# Altium project mb1367.PrjPcb
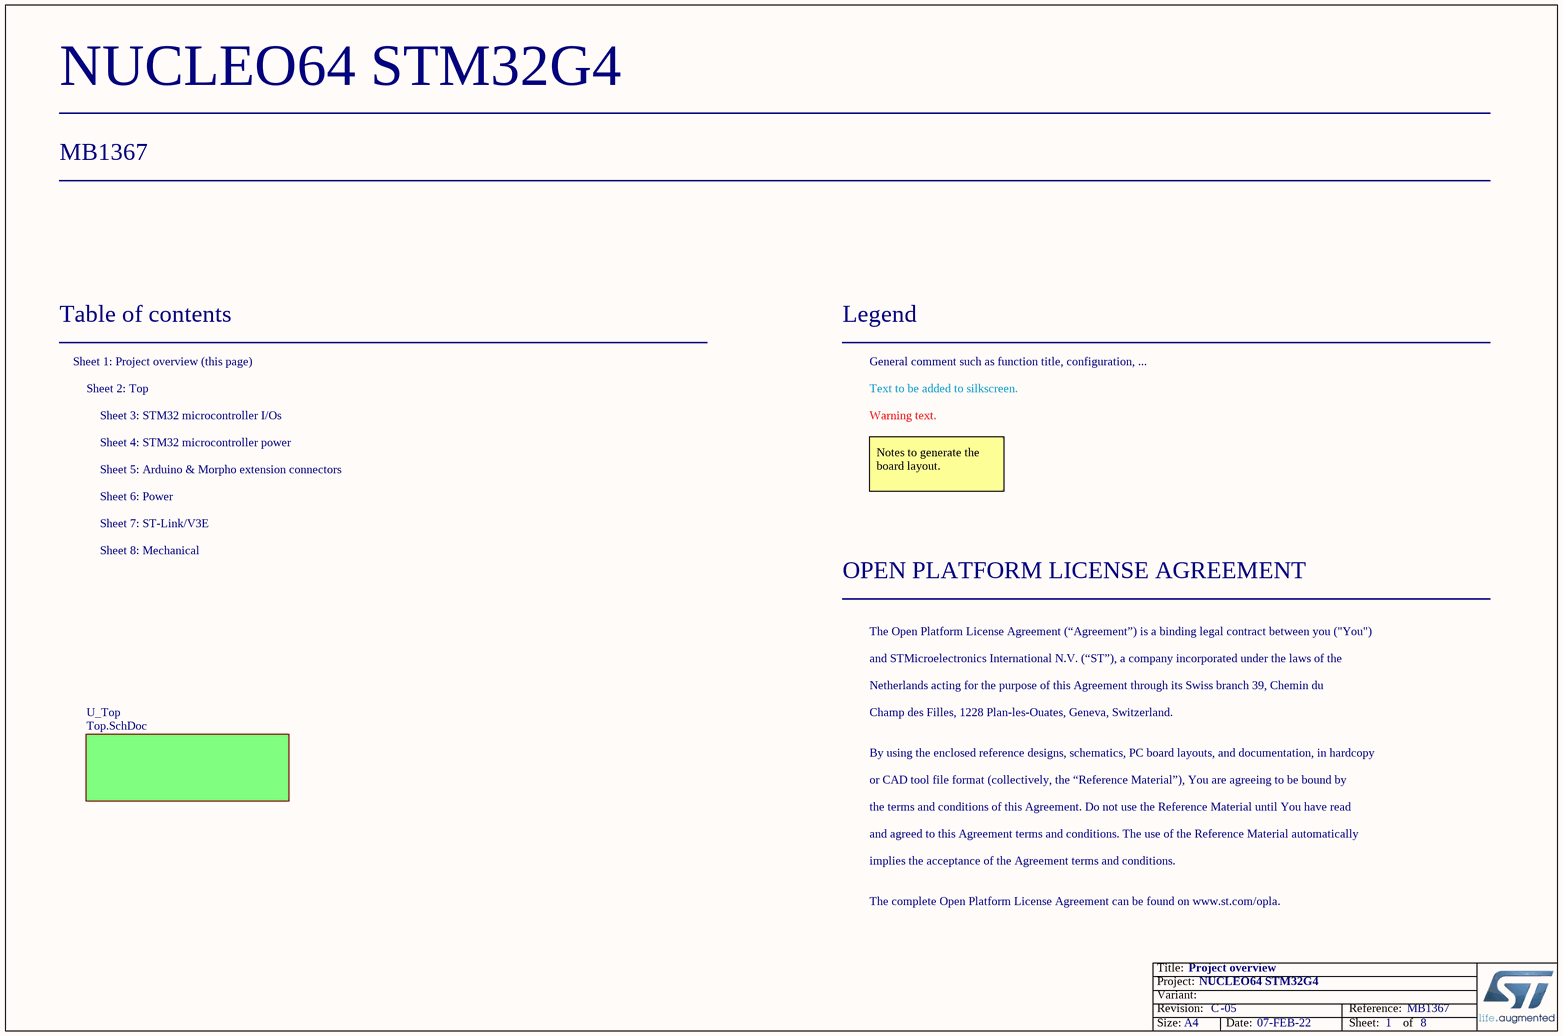
[diagram p0: Project_Overview.SchDoc]
Board_Assembly_Revision: 05; Board_Document_Date: 07-FEB-22; Board_Name: NUCLEO64 STM32G4; Board_PCB_Revision: C; Board_Reference: MB1367
4 sheets, 128 parts. Net scope: flat (ports and power ports of the same name join across sheets).
Board file: MB1367.PcbDoc
Sheets:
  Project_Overview.SchDoc
  Arduino_extension_connectors.SchDoc
  Power.SchDoc
  ST_LINK_V3E.SchDoc

## Sheet Project_Overview.SchDoc: Project overview
size A4; Date: Not used; ApprovedBy: Not used; CheckedBy: Not used; Author: Not used; CompanyName: STMicroelectronics; DrawnBy: Not used; Engineer: Not used; Organization: Not used; Address1: Not used; Address2: Not used; Address3: Not used; Address4: Not used; DocumentNumber: 1; Revision: Not used; SheetNumber: 1; SheetTotal: 8; CurrentTime: Not used; CurrentDate: Not used; Time: Not used; DocumentFullPathAndName: Not used; DocumentName: Not used; ModifiedDate: Not used; ImagePath: Not used; ProjectName: Not used; Application_BuildNumber: Not used

### Sub-sheets
U_Top = Top.SchDoc (file not in this document): no entries

### Notes on the sheet
- Table of contents
- Sheet 1: Project overview (this page)
- Legend
- General comment such as function title, configuration, ...
- Sheet 2: Top
- Sheet 4: STM32 microcontroller power
- Sheet 3: STM32 microcontroller I/Os
- Text to be added to silkscreen.
- Warning text.
- Sheet 6: Power
- Sheet 5: Arduino & Morpho extension connectors
- Notes to generate the board layout.
- Sheet 7: ST-Link/V3E
- Sheet 8: Mechanical
- OPEN PLATFORM LICENSE AGREEMENT
- The Open Platform License Agreement (“Agreement”) is a binding legal contract between you ("You")
- and STMicroelectronics International N.V. (“ST”), a company incorporated under the laws of the
- Netherlands acting for the purpose of this Agreement through its Swiss branch 39, Chemin du
- Champ des Filles, 1228 Plan-les-Ouates, Geneva, Switzerland.
- By using the enclosed reference designs, schematics, PC board layouts, and documentation, in hardcopy
- or CAD tool file format (collectively, the “Reference Material”), You are agreeing to be bound by
- the terms and conditions of this Agreement. Do not use the Reference Material until You have read
- and agreed to this Agreement terms and conditions. The use of the Reference Material automatically
- implies the acceptance of the Agreement terms and conditions.
- The complete Open Platform License Agreement can be found on www.st.com/opla.
- Title:
- Project:
- Size:
- Revision:
- Variant:
- A4
- -
- Date:
- Reference:
- Sheet:
- of

## Sheet Arduino_extension_connectors.SchDoc: Arduino & Morpho extension connectors
size A4; Date: Not used; ApprovedBy: Not used; CheckedBy: Not used; Author: Not used; CompanyName: STMicroelectronics; DrawnBy: Not used; Engineer: Not used; Organization: Not used; Address1: Not used; Address2: Not used; Address3: Not used; Address4: Not used; DocumentNumber: 5; Revision: Not used; SheetNumber: 5; SheetTotal: 8; CurrentTime: Not used; CurrentDate: Not used; Time: Not used; DocumentFullPathAndName: Not used; DocumentName: Not used; ModifiedDate: Not used; ImagePath: Not used; ProjectName: Not used; Application_BuildNumber: Not used
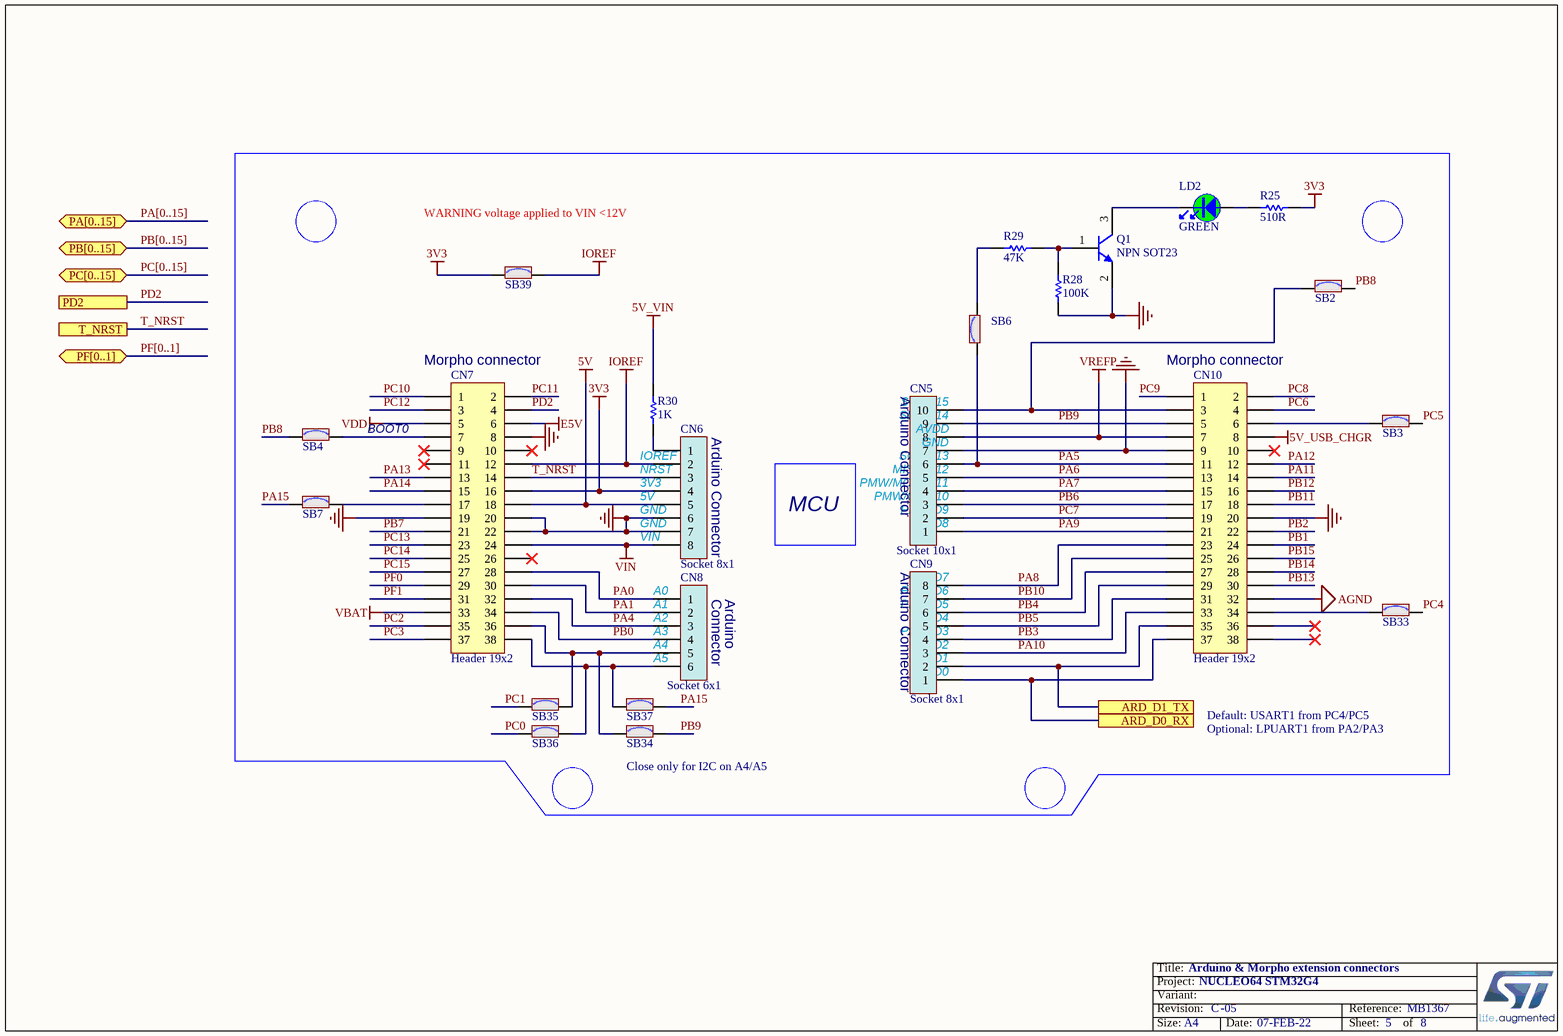
[diagram p1: Arduino_extension_connectors.SchDoc]

### Parts
CN5  value Socket 10x1  [CON_SAMTEC_SSW-110-03-X-S]
CN6  value Socket 8x1  [CON_SAMTEC_SSW-108-03-X-S]
CN7  value Header 19x2  [CON_SAMTEC_TSW-119-09-X-D]
CN8  value Socket 6x1  [CON_SAMTEC_SSW-106-03-X-S]
CN9  value Socket 8x1  [CON_SAMTEC_SSW-108-03-X-S]
CN10  value Header 19x2  [CON_SAMTEC_TSW-119-09-X-D]
LD2  value GREEN  [LED_0603_GREEN]  (hidden comment: LED_green)
Q1  value NPN SOT23  [NPN_SOT23]
R25  value 510R  [R0603]
R28  value 100K  [R0603]
R29  value 47K  [R0603]
R30  value 1K  [R0603]
SB2  (no value)  [SOLDER-BRIDGE_R0603-0R]
SB3  (no value)  [SOLDER-BRIDGE_R0603-0R]
SB4  (no value)  [SOLDER-BRIDGE_R0603-0R]
SB6  (no value)  [SOLDER-BRIDGE_R0603-0R]
SB7  (no value)  [SOLDER-BRIDGE_R0603-0R]
SB33  (no value)  [SOLDER-BRIDGE_R0603-0R]
SB34  (no value)  [SOLDER-BRIDGE_R0603-0R]
SB35  (no value)  [SOLDER-BRIDGE_R0603-0R]
SB36  (no value)  [SOLDER-BRIDGE_R0603-0R]
SB37  (no value)  [SOLDER-BRIDGE_R0603-0R]
SB39  (no value)  [SOLDER-BRIDGE_R0603-0R]

### Ports
ARD_D0_RX, ARD_D1_TX, PA[0..15] (bidir), PB[0..15] (bidir), PC[0..15] (bidir), PD2, PF[0..1] (bidir), T_NRST

### Nets
3V3: CN6.4 CN7.16 R25.1 SB39.1
5V: CN6.5 CN7.18
5V_USB_CHGR: CN10.8
5V_VIN: R30.2
AGND: CN10.32
E5V: CN7.6
GND: CN5.7 CN6.6 CN6.7 CN7.8 CN7.19 CN7.20 CN7.22 CN10.9 CN10.20 Q1.2(E) R28.1
IOREF: CN6.2 CN7.12 SB39.2
VBAT: CN7.33
VDD: CN7.5
VIN: CN6.8 CN7.24
VREFP: CN5.8 CN10.7
ARD_D0_RX: CN9.1 CN10.37 ; port ARD_D0_RX
ARD_D1_TX: CN9.2 CN10.35 ; port ARD_D1_TX
PA0: CN7.28 CN8.1
PA1: CN7.30 CN8.2
PA4: CN7.32 CN8.3
PA5: CN5.6 CN10.11 SB6.1
PA6: CN5.5 CN10.13
PA7: CN5.4 CN10.15
PA8: CN9.8 CN10.23
PA9: CN5.1 CN10.21
PA10: CN9.3 CN10.33
PA11: CN10.14
PA12: CN10.12
PA13: CN7.13
PA14: CN7.15
PA15: SB7.1 SB37.2
PB0: CN7.34 CN8.4
PB1: CN10.24
PB2: CN10.22
PB3: CN9.4 CN10.31
PB4: CN9.6 CN10.27
PB5: CN9.5 CN10.29
PB6: CN5.3 CN10.17
PB7: CN7.21
PB8: SB2.2 SB4.1
PB9: CN5.9 CN10.5 SB34.2
PB10: CN9.7 CN10.25
PB11: CN10.18
PB12: CN10.16
PB13: CN10.30
PB14: CN10.28
PB15: CN10.26
PC0: SB36.1
PC1: SB35.1
PC2: CN7.35
PC3: CN7.37
PC4: SB33.2
PC5: SB3.2
PC6: CN10.4
PC7: CN5.2 CN10.19
PC8: CN10.2
PC9: CN10.1
PC10: CN7.1
PC11: CN7.2
PC12: CN7.3
PC13: CN7.23
PC14: CN7.25
PC15: CN7.27
PD2: CN7.4 ; port PD2
PF0: CN7.29
PF1: CN7.31
T_NRST: CN6.3 CN7.14 ; port T_NRST
NetCN5_10: CN5.10 CN10.3 SB2.1
NetCN6_1: CN6.1 R30.1
NetCN7_7: CN7.7 SB4.2
NetCN7_17: CN7.17 SB7.2
NetCN7_36: CN7.36 CN8.5 SB34.1 SB35.2
NetCN7_38: CN7.38 CN8.6 SB36.2 SB37.1
NetCN10_6: CN10.6 SB3.1
NetCN10_34: CN10.34 SB33.1
NetLD2_1: LD2.1 R25.2
NetLD2_2: LD2.2 Q1.3(C)
NetQ1_1: Q1.1(B) R28.2 R29.2
NetR29_1: R29.1 SB6.2

Not connected (* = marked no-connect by the designer): CN7 9* 10* 11* 26*; CN10 10* 36* 38*

### Buses and harness runs
bus PA[0..15] = port PA[0..15]
bus PB[0..15] = port PB[0..15]
bus PC[0..15] = port PC[0..15]
bus PF[0..1] = port PF[0..1]

### Notes on the sheet
- WARNING voltage applied to VIN <12V
- (near CN7) Morpho connector
- (near CN10) Morpho connector
- (near CN7) BOOT0
- (near CN6) Arduino Connector
- (near CN5) Arduino Connector
- (near CN5) SDA/D14
- (near CN5) SCL/D15
- (near CN5) AVDD
- (near CN5) GND
- (near CN6) GND
- (near CN6) 5V
- (near CN6) 3V3
- (near CN6) NRST
- (near CN6) IOREF
- MCU
- (near CN5) PMW/D9
- (near CN5) PMW/CS/D10
- (near CN5) SCK/D13
- (near CN5) MISO/D12
- (near CN5) PMW/MOSI/D11
- (near CN6) VIN
- (near CN9) Arduino Connector
- (near CN9) D7
- (near CN5) D8
- (near CN8) A0
- (near CN8) A1
- (near CN8) A2
- (near CN8) A3
- (near CN8) A4
- (near CN8) Connector
- (near CN8) Arduino
- (near CN9) D2
- (near CN9) D4
- (near CN9) PMW/D3
- (near CN9) PMW/D5
- (near CN9) PMW/D6
- (near CN8) A5
- (near CN9) RX/D0
- (near CN9) TX/D1
- (near SB34) Close only for I2C on A4/A5
- Default: USART1 from PC4/PC5
  Optional: LPUART1 from PA2/PA3
- Title:
- Project:
- Size:
- Revision:
- Variant:
- -
- Date:
- Reference:
- Sheet:
- of

### Library data of the parts
CN5 = MCD-00262: Socket, 10x1, 2.54mm, VR, TH, Height 8.51mm/10mm; Manufacturer_Part_Number: SSW-110-03-x-S; Manufacturer: SAMTEC; Part_Type: Connector; Provided_By: SUBCO; Internal_Part_Number: MCD-00262; ECCN_US: n/a; ECCN_EU: n/a; ComponentLink1Description: Datasheet; Status: Released; ComponentLink1URL: http://tunmcdsvn.tun.st.com/Component_Datasheet_Library/Trunk/Connectors/Samtec_SSW-SSQ-series
CN6 CN9 = MCD-00261: Socket, 8x1, 2.54mm, VR, TH, Height 8.51mm/10mm; Manufacturer_Part_Number: SSW-108-03-x-S; Manufacturer: SAMTEC; Part_Type: Connector; Provided_By: SUBCO; Internal_Part_Number: MCD-00261; ECCN_US: n/a; ECCN_EU: n/a; ComponentLink1Description: Datasheet; Status: Released; ComponentLink1URL: http://tunmcdsvn.tun.st.com/Component_Datasheet_Library/Trunk/Connectors/Samtec_SSW-SSQ-series
CN7 CN10 = MCD-00213: Header, 19x2, 2,54mm, VR, TH, Height 5.84mm/10.16mm; Manufacturer_Part_Number: TSW-119-09-x-D; Manufacturer: SAMTEC; Part_Type: Connector; Provided_By: SUBCO; Internal_Part_Number: MCD-00213; ECCN_US: n/a; ECCN_EU: n/a; ComponentLink1Description: Datasheet; Status: Released; ComponentLink1URL: http://tunmcdsvn.tun.st.com/Component_Datasheet_Library/Trunk/Connectors/Samtec_TSW-HTSW-series
CN8 = MCD-00260: Socket, 6x1, 2.54mm, VR, TH, Height 8.51mm/10mm; Manufacturer_Part_Number: SSW-106-03-x-S; Manufacturer: SAMTEC; Part_Type: Connector; Provided_By: SUBCO; Internal_Part_Number: MCD-00260; ECCN_US: n/a; ECCN_EU: n/a; ComponentLink1Description: Datasheet; Status: Released; ComponentLink1URL: http://tunmcdsvn.tun.st.com/Component_Datasheet_Library/Trunk/Connectors/Samtec_SSW-SSQ-series
LD2 = MCD-02520: LED, GREEN, 0603, VF : 2.4V max ; IF: 20mA; Part_Type: Display; Part_Preference: Recommended; Manufacturer: OSRAM OPTO SEMICONDUCTORS; Manufacturer_Part_Number: LG Q396-PS-35; ShowFields: YES; ID: 4626; Internal_Part_Number: MCD-02520; Status: Checked; Package: 0603; ComponentLink1URL: http://tunmcdsvn.tun.st.com/Component_Documentation_Library/Trunk/Display/OSRAM_LG-Q396_Series; Order_Code_Digikey: 475-3754-1-ND; Order_Code_Farnell: 2575345RL; Order_Code_RS: N/A
Q1 = MCD-00073: NPN Bipolar Transistor; Part_Type: IC; Manufacturer_Part_Number: BSR14; Manufacturer: ON SEMICONDUCTOR; Alternate_Manufacturer_Part_Number: MMBT2222LT1G / MMBT2222ALT1G / MMBT2222ALT3G; ECCN_US: EAR99; ECCN_EU: NEC; Provided_By: SUBCO; Revision: *; Internal_Part_Number: MCD-00073; Status: Released; ComponentLink1Description: Datasheet; ComponentLink1URL: http://tunmcdsvn.tun.st.com/Component_Datasheet_Library/Trunk/IC/NXP_Transistor_BSR14; Alternate_Manufacturer: ON SEMICONDUCTOR; Package: SOT23
R25 = MCD-00225: Resistor,510R,0603,1%,1/10W; Manufacturer_Part_Number: RC0603FR-07510RL; Manufacturer: YAGEO; ECCN_US: EAR99; ECCN_EU: NEC; Provided_By: SUBCO; Internal_Part_Number: MCD-00225; ComponentLink1Description: Datasheet; Status: Released; Part_Type: Resistor; Package: R0603; ComponentLink1URL: http://tunmcdsvn.tun.st.com/Component_Datasheet_Library/Trunk/Resistors/Yageo_Resistor_RC0603-series
R28 = MCD-00223: Resistor,100K,0603,1%,1/10W; Manufacturer_Part_Number: RC0603FR-07100KL; Manufacturer: YAGEO; Provided_By: Subcon; Initial_Board_Reference: MB1319; Internal_Part_Number: MCD-00223; Status: Released; Part_Type: Resistor; ComponentLink1Description: Yageo_Resistor_RC0603-series.pdf; ECCN_US: n/a; ECCN_EU: n/a; Package: R0603; ComponentLink1URL: http://tunmcdsvn.tun.st.com/Component_Datasheet_Library/Trunk/Resistors/Yageo_Resistor_RC0603-series
R29 = MCD-00222: Resistor,47K,0603,1%,1/10W; Manufacturer_Part_Number: RC0603FR-0747KL; Manufacturer: YAGEO; ECCN_US: EAR99; ECCN_EU: NEC; Provided_By: SUBCO; Internal_Part_Number: MCD-00222; Status: Released; Part_Type: Resistor; ComponentLink1Description: Datasheet; Package: R0603; ComponentLink1URL: http://tunmcdsvn.tun.st.com/Component_Datasheet_Library/Trunk/Resistors/Yageo_Resistor_RC0603-series
R30 = MCD-00070: Resistor,1K,0603,1%,1/10W; Manufacturer_Part_Number: RC0603FR-071KL; Manufacturer: YAGEO; Provided_By: Subcon; Initial_Board_Reference: MB1274; Internal_Part_Number: MCD-00070; ComponentLink1Description: Yageo_Resistor_RC0603-series.pdf; ECCN_US: n/a; ECCN_EU: n/a; Status: Released; Part_Type: Resistor; Package: R0603; ComponentLink1URL: http://tunmcdsvn.tun.st.com/Component_Datasheet_Library/Trunk/Resistors/Yageo_Resistor_RC0603-series
SB2-SB4 SB6 SB7 SB33-SB37 SB39 = MCD-00071: Solder Bridge ON; Part_Type: Mechanical; Manufacturer_Part_Number: RC0603JR-070RL; Manufacturer: YAGEO; Provided_By: SUBCO; Internal_Part_Number: MCD-00071; ECCN_US: n/a; ECCN_EU: n/a; Status: Released; Package: SB0603; ComponentLink1Description: Datasheet; ComponentLink1URL: http://tunmcdsvn.tun.st.com/Component_Datasheet_Library/Trunk/Resistors/Yageo_Resistor_RC0603-series

## Sheet Power.SchDoc: Main power 5V / 3V3
size A4; Date: Not used; ApprovedBy: Not used; CheckedBy: Not used; Author: Not used; CompanyName: STMicroelectronics; DrawnBy: Not used; Engineer: Not used; Organization: Not used; Address1: Not used; Address2: Not used; Address3: Not used; Address4: Not used; DocumentNumber: 6; Revision: Not used; SheetNumber: 6; SheetTotal: 8; CurrentTime: Not used; CurrentDate: Not used; Time: Not used; DocumentFullPathAndName: Not used; DocumentName: Not used; ModifiedDate: Not used; ImagePath: Not used; ProjectName: Not used; Application_BuildNumber: Not used
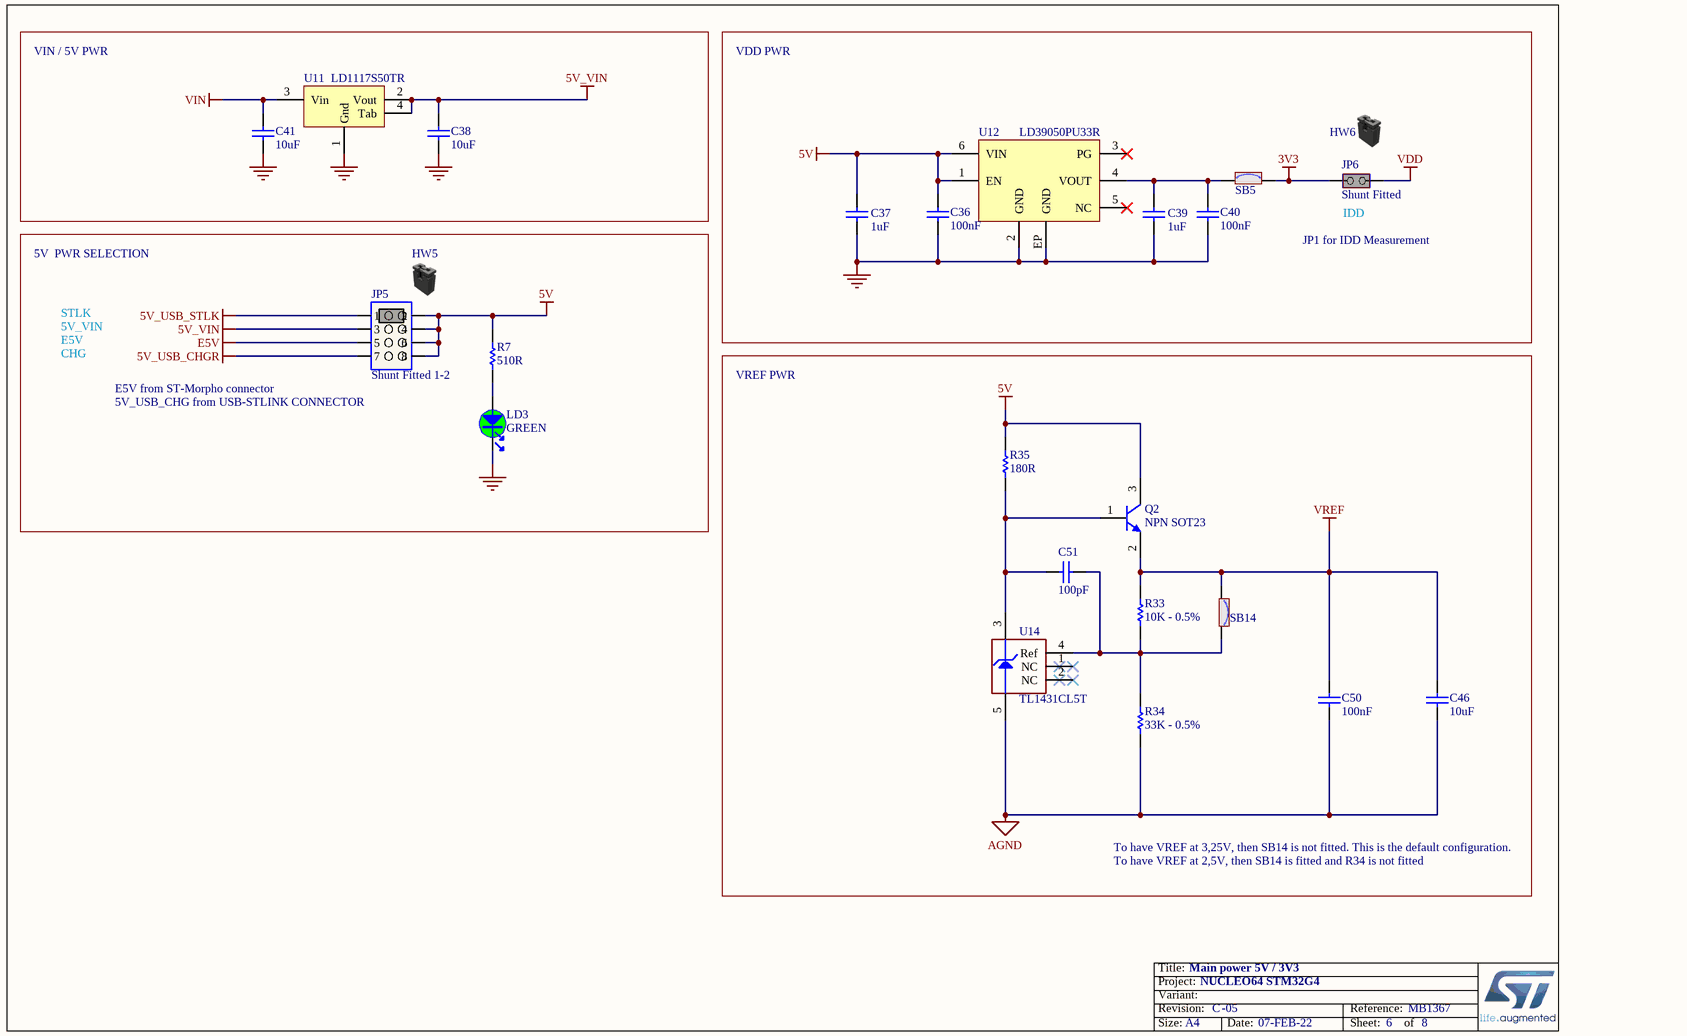
[diagram p2: Power.SchDoc]

### Parts
C36  value 100nF  [C0402]
C37  value 1uF  [C0603]
C38  value 10uF  [C0805]
C39  value 1uF  [C0603]
C40  value 100nF  [C0402]
C41  value 10uF  [C0805]
C46  value 10uF  [C0603]
C50  value 100nF  [C0603]
C51  value 100pF  [C0603]
HW5  (no value)  (mechanical)
HW6  (no value)  (mechanical)
JP5  value Shunt Fitted 1-2  [CON_SAMTEC_TSW-104-07-X-D]
JP6  Shunt Fitted  [CON_SAMTEC_TSW-102-07-G-S]
LD3  value GREEN  [LED_0603_GREEN]  (hidden comment: LED_green)
Q2  value NPN SOT23  [NPN_SOT23]
R7  value 510R  [R0603]
R33  value 10K - 0.5%  [R0603]
R34  value 33K - 0.5%  [R0603]
R35  value 180R  [R0603]
SB5  (no value)  [SOLDER-BRIDGE_R0603-0R]
SB14  (no value)  [SOLDER-BRIDGE_R0603-0R]
U11  value LD1117S50TR  [REG_SOT223-TAB]
U12  value LD39050PU33R  [ICC_DFN6-EPAD_3X3_P095]
U14  value TL1431CL5T  [ICC_SOT23-5L_H1P45]

### Blocks framed on the sheet
VIN / 5V PWR: C38 C41 U11
VREF PWR: C46 C50 C51 Q2 R33-R35 SB14 U14

### Nets
3V3: JP6.1(COMMON) SB5.2
5V: C36.2 C37.2 JP5.2 JP5.4 JP5.6 JP5.8 Q2.3(C) R7.2 R35.2 U12.1(EN) U12.6(VIN)
5V_USB_CHGR: JP5.7
5V_USB_STLK: JP5.1
5V_VIN: C38.2 JP5.3 U11.2(Vout) U11.4(Tab)
AGND: C46.1 C50.1 R34.1 U14.5(Anode)
E5V: JP5.5
GND: C36.1 C37.1 C38.1 C39.1 C40.1 C41.1 LD3.2 U11.1(Gnd) U12.2(GND) U12.EP(GND)
VDD: JP6.2(NO)
VIN: C41.2 U11.3(Vin)
VREF: C46.2 C50.2 Q2.2(E) R33.2 SB14.1
NetC39_2: C39.2 C40.2 SB5.1 U12.4(VOUT)
NetC51_1: C51.1 Q2.1(B) R35.1 U14.3(Cathode)
NetC51_2: C51.2 R33.1 R34.2 SB14.2 U14.4(Ref)
NetLD3_1: LD3.1 R7.1

Not connected (* = marked no-connect by the designer): U12 3(PG)* 5(NC)*; U14 1(NC)* 2(NC)*

### Notes on the sheet
- VDD PWR
- JP1 for IDD Measurement
- (near JP6) IDD
- 5V  PWR SELECTION
- STLK
- E5V
- 5V_VIN
- CHG
- E5V from ST-Morpho connector
- 5V_USB_CHG from USB-STLINK CONNECTOR
- To have VREF at 3,25V, then SB14 is not fitted. This is the default configuration.
- To have VREF at 2,5V, then SB14 is fitted and R34 is not fitted
- Title:
- Project:
- Size:
- Revision:
- Variant:
- A4
- -
- Date:
- Reference:
- Sheet:
- of

### Library data of the parts
C36 C40 = MCD-00102: Capacitor, MLCC, 100nF, 16V, X7R, 10%, 0402, T=0,5mm; Manufacturer_Part_Number: CC0402KRX7R7BB104; Manufacturer: YAGEO; Provided_By: Subcon; Initial_Board_Reference: MB1262; Internal_Part_Number: MCD-00102; Status: Released; Package: C0402; ComponentLink1Description: Yageo_Capacitor_X7R-series.pdf; ECCN_US: n/a; ECCN_EU: n/a; Part_Type: Capacitor; ComponentLink1URL: http://tunmcdsvn.tun.st.com/Component_Datasheet_Library/Trunk/Capacitors/Yageo_Multilayer_Capacitor_X7R_series_100pF_to_22uF
C37 C39 = MCD-00010: Capacitor, MLCC, 1uF, 16V, X5R, 10%, 0603, T=0,8mm; Manufacturer_Part_Number: CC0603KRX5R7BB105; Manufacturer: YAGEO; Provided_By: Subcon; Initial_Board_Reference: MB1274; Internal_Part_Number: MCD-00010; Status: Released; Package: C0603; ComponentLink1Description: Yageo_Capacitor_X5R-series.pdf; ECCN_US: n/a; ECCN_EU: n/a; Part_Type: Capacitor; ComponentLink1URL: http://tunmcdsvn.tun.st.com/Component_Datasheet_Library/Trunk/Capacitors/Yageo_Multilayer_capacitor_X5R_series_100pF_to_100uF
C38 C41 = MCD-00014: Capacitor, MLCC, 10uF, 25V, X5R, 10%, 0805, T=0,85mm; Manufacturer_Part_Number: CC0805KRX5R8BB106; Manufacturer: YAGEO; ECCN_US: EAR99; ECCN_EU: NEC; Provided_By: SUBCO; Internal_Part_Number: MCD-00014; ComponentLink1Description: Datasheet; Status: Released; Part_Type: Capacitor; Package: C0805; ComponentLink1URL: http://tunmcdsvn.tun.st.com/Component_Datasheet_Library/Trunk/Capacitors/Yageo_Multilayer_capacitor_X5R_series_100pF_to_100uF
C46 = MCD-01124: Capacitor, MLCC, 10uF, 10V, X5R, 10%, 0603, T=0.8mm; Manufacturer_Part_Number: GRM188R61A106KAAL; Manufacturer: MURATA; ECCN_US: EAR99; ECCN_EU: NEC; Provided_By: SUBCO; Internal_Part_Number: MCD-01124; Status: Released; Part_Type: Capacitor; Package: C0603; ComponentLink1Description: Datasheet; ComponentLink1URL: http://tunmcdsvn.tun.st.com/Component_Datasheet_Library/Trunk/Capacitors/Murata_Capacitor_GR_series
C50 = MCD-00211: Capacitor, MLCC, 100nF, 16V, X7R, 10%, 0603, T=0,8mm; Manufacturer_Part_Number: CC0603KRX7R7BB104; Manufacturer: YAGEO; ECCN_US: EAR99; ECCN_EU: NEC; Provided_By: SUBCO; Internal_Part_Number: MCD-00211; Status: Released; Part_Type: Capacitor; Package: C0603; ComponentLink1Description: Datasheet; ComponentLink1URL: http://tunmcdsvn.tun.st.com/Component_Datasheet_Library/Trunk/Capacitors/Yageo_Multilayer_Capacitor_X7R_series_100pF_to_22uF
C51 = MCD-01101: Capacitor,100pF,50V,X7R,10%,0603; Manufacturer_Part_Number: 06035C101JAT4A; Manufacturer: AVX; ECCN_US: EAR99; ECCN_EU: NEC; Provided_By: SUBCO; Internal_Part_Number: MCD-01101; Status: Checked; Part_Type: Capacitor; Package: C0603; ComponentLink1Description: Datasheet; ComponentLink1URL: http://tunmcdsvn.tun.st.com/Component_Datasheet_Library/Trunk/Capacitors/AVX_Capacitor_X7R-series/AVX_X7R-series.pdf; Alternate_Manufacturer_Part_Number: N/A; Alternate_Manufacturer: N/A; Order_Code_Digikey: 06035C101JAT4A-ND; Order_Code_Farnell: N/A; Order_Code_RS: N/A; BMS_Part_Number: N/A
HW5 HW6 = MCD-00043: SHUNT 2.54mm BLACK; Manufacturer_Part_Number: SNT-100-BK-G; Manufacturer: SAMTEC; Part_Type: Mechanical; Provided_By: Subcon; Initial_Board_Reference: MB1274; Internal_Part_Number: MCD-00043; ECCN_US: n/a; ECCN_EU: n/a; ComponentLink1Description: Samtec_Shunt_Jumper_SNT100.pdf; Status: Released; ComponentLink1URL: http://tunmcdsvn.tun.st.com/Component_Datasheet_Library/Trunk/Connectors/Samtec_Shunt_Jumper_SNT100
JP5 = MCD-00686: Header, 4x2, 2,54mm, VR, TH, Height 5.84mm/2.54mm - Shunt Fitted 1-2; Part_Type: Connector; Manufacturer_Part_Number: TSW-104-07-x-D; Manufacturer: SAMTEC; Provided_By: SUBCO; Internal_Part_Number: MCD-00686; Status: Released; ComponentLink1Description: Datasheet; ComponentLink1URL: http://tunmcdsvn.tun.st.com/Component_Datasheet_Library/Trunk/Connectors/Samtec_TSW-HTSW-series; ECCN_US: n/a; ECCN_EU: n/a
JP6 = MCD-00683: Header, 2x1, 2,54mm, VR, TH, Height 5.84mm/2.54mm - Shunt Fitted by default; Part_Type: Connector; Manufacturer_Part_Number: TSW-102-07-x-S; Manufacturer: SAMTEC; Provided_By: Subcon; Initial_Board_Reference: MB1331; Internal_Part_Number: MCD-00683; Value: Shunt Fitted; Status: Released; ComponentLink1Description: Samtec_connector_TSW-HTSW-series.pdf; ComponentLink1URL: http://tunmcdsvn.tun.st.com/Component_Datasheet_Library/Trunk/Connectors/Samtec_TSW-HTSW-series; ECCN_US: n/a; ECCN_EU: n/a
LD3 = MCD-02520: as LD2 on sheet Arduino_extension_connectors; Internal_Part_Number: MCD-02520; Status: Checked; Package: 0603; ComponentLink1URL: http://tunmcdsvn.tun.st.com/Component_Documentation_Library/Trunk/Display/OSRAM_LG-Q396_Series; Order_Code_Digikey: 475-3754-1-ND; Order_Code_Farnell: 2575345RL; Order_Code_RS: N/A
Q2 = MCD-00073: as Q1 on sheet Arduino_extension_connectors; Revision: *; Internal_Part_Number: MCD-00073; Status: Released; ComponentLink1Description: Datasheet; ComponentLink1URL: http://tunmcdsvn.tun.st.com/Component_Datasheet_Library/Trunk/IC/NXP_Transistor_BSR14; Alternate_Manufacturer: ON SEMICONDUCTOR; Package: SOT23
R7 = MCD-00225: as R25 on sheet Arduino_extension_connectors; Internal_Part_Number: MCD-00225; ComponentLink1Description: Datasheet; Status: Released; Part_Type: Resistor; Package: R0603; ComponentLink1URL: http://tunmcdsvn.tun.st.com/Component_Datasheet_Library/Trunk/Resistors/Yageo_Resistor_RC0603-series
R33 = MCD-01215: resistor, 10K, 0603, 0.5%, 1/10W; Manufacturer_Part_Number: RC0603DR-0710KL; Manufacturer: YAGEO; ECCN_US: EAR99; ECCN_EU: NEC; Provided_By: SUBCO; Internal_Part_Number: MCD-01215; Status: Checked; Part_Type: Resistor; Package: R0603; ComponentLink1Description: Datasheet; ComponentLink1URL: http://tunmcdsvn.tun.st.com/Component_Datasheet_Library/Trunk/Resistors/Yageo_Resistor_RC0603-series/RC_Group_51_RoHS_L_7.pdf
R34 = MCD-01209: Resistor,33K,0603,0.5%,1/10W; Manufacturer_Part_Number: RC0603DR-0733KL; Manufacturer: YAGEO; ECCN_US: EAR99; ECCN_EU: NEC; Provided_By: SUBCO; Internal_Part_Number: MCD-01209; Status: Checked; Part_Type: Resistor; Package: R0603; ComponentLink1Description: Datasheet; ComponentLink1URL: http://tunmcdsvn.tun.st.com/Component_Datasheet_Library/Trunk/Resistors/Yageo_Resistor_RC0603-series/RC_Group_51_RoHS_L_7.pdf
R35 = MCD-00342: Resistor,180R,0603,1%,1/10W; Manufacturer_Part_Number: RC0603FR-07180RL; Manufacturer: YAGEO; ECCN_US: EAR99; ECCN_EU: NEC; Provided_By: SUBCO; Internal_Part_Number: MCD-00342; Status: Released; Part_Type: Resistor; Package: R0603; ComponentLink1Description: Datasheet; ComponentLink1URL: http://tunmcdsvn.tun.st.com/Component_Datasheet_Library/Trunk/Resistors/Yageo_Resistor_RC0603-series
SB5 SB14 = MCD-00071: as SB2 on sheet Arduino_extension_connectors; Internal_Part_Number: MCD-00071; ECCN_US: n/a; ECCN_EU: n/a; Status: Released; Package: SB0603; ComponentLink1Description: Datasheet; ComponentLink1URL: http://tunmcdsvn.tun.st.com/Component_Datasheet_Library/Trunk/Resistors/Yageo_Resistor_RC0603-series
U11 = MCD-00088: IC REG LDO 5V 0.8A SOT223; Manufacturer: STMICROELECTRONICS; BMS_Part_Number: 9176133; ECCN_US: EAR99; ECCN_EU: NEC; Provided_By: SUBCO with ST control; Internal_Part_Number: MCD-00088; Manufacturer_Part_Number: LD1117S50TR; ComponentLink1Description: Datasheet; Status: Released; Part_Type: IC; ComponentLink1URL: http://tunmcdsvn.tun.st.com/Component_Datasheet_Library/Trunk/IC/STM_LDO_LD1117; Package: SOT-223
U12 = MCD-00215: Low quiescent current and low noise voltage regulators; Manufacturer: STMICROELECTRONICS; Part_Type: IC; BMS_Part_Number: 9176126; ECCN_US: EAR99; ECCN_EU: NEC; Provided_By: SUBCO with ST control; Internal_Part_Number: MCD-00215; Manufacturer_Part_Number: LD39050PU33R; Status: Released; ComponentLink1Description: Datasheet; ComponentLink1URL: http://tunmcdsvn.tun.st.com/Component_Datasheet_Library/Trunk/IC/STM_LDO_LD39050PU; Package: DFN6 3x3mm
U14 = MCD-01802: Programmable voltage reference with 0.4% voltage precision; Part_Type: IC; Manufacturer: STMICROELECTRONICS; BMS_Part_Number: 9176334; ECCN_US: EAR99; ECCN_EU: NEC; Provided_By: SUBCO with ST control; Internal_Part_Number: MCD-01802; Status: Footprint available; Manufacturer_Part_Number: TL1431CL5T; Package: SOT23-5L; ComponentLink1Description: Datasheet; ComponentLink1URL: http://tunmcdsvn.tun.st.com/Component_Datasheet_Library/Trunk/IC/STM_voltage_reference_TL1431ACL5T/

## Sheet ST_LINK_V3E.SchDoc: STLINK_V3E
size A3; Date: Not used; ApprovedBy: Not used; CheckedBy: Not used; Author: Not used; CompanyName: STMicroelectronics; DrawnBy: Not used; Engineer: Not used; Organization: Not used; Address1: Not used; Address2: Not used; Address3: Not used; Address4: Not used; DocumentNumber: 7; Revision: Not used; SheetNumber: 7; SheetTotal: 8; CurrentTime: Not used; CurrentDate: Not used; Time: Not used; DocumentFullPathAndName: Not used; DocumentName: Not used; ModifiedDate: Not used; ImagePath: Not used; ProjectName: Not used; Application_BuildNumber: Not used
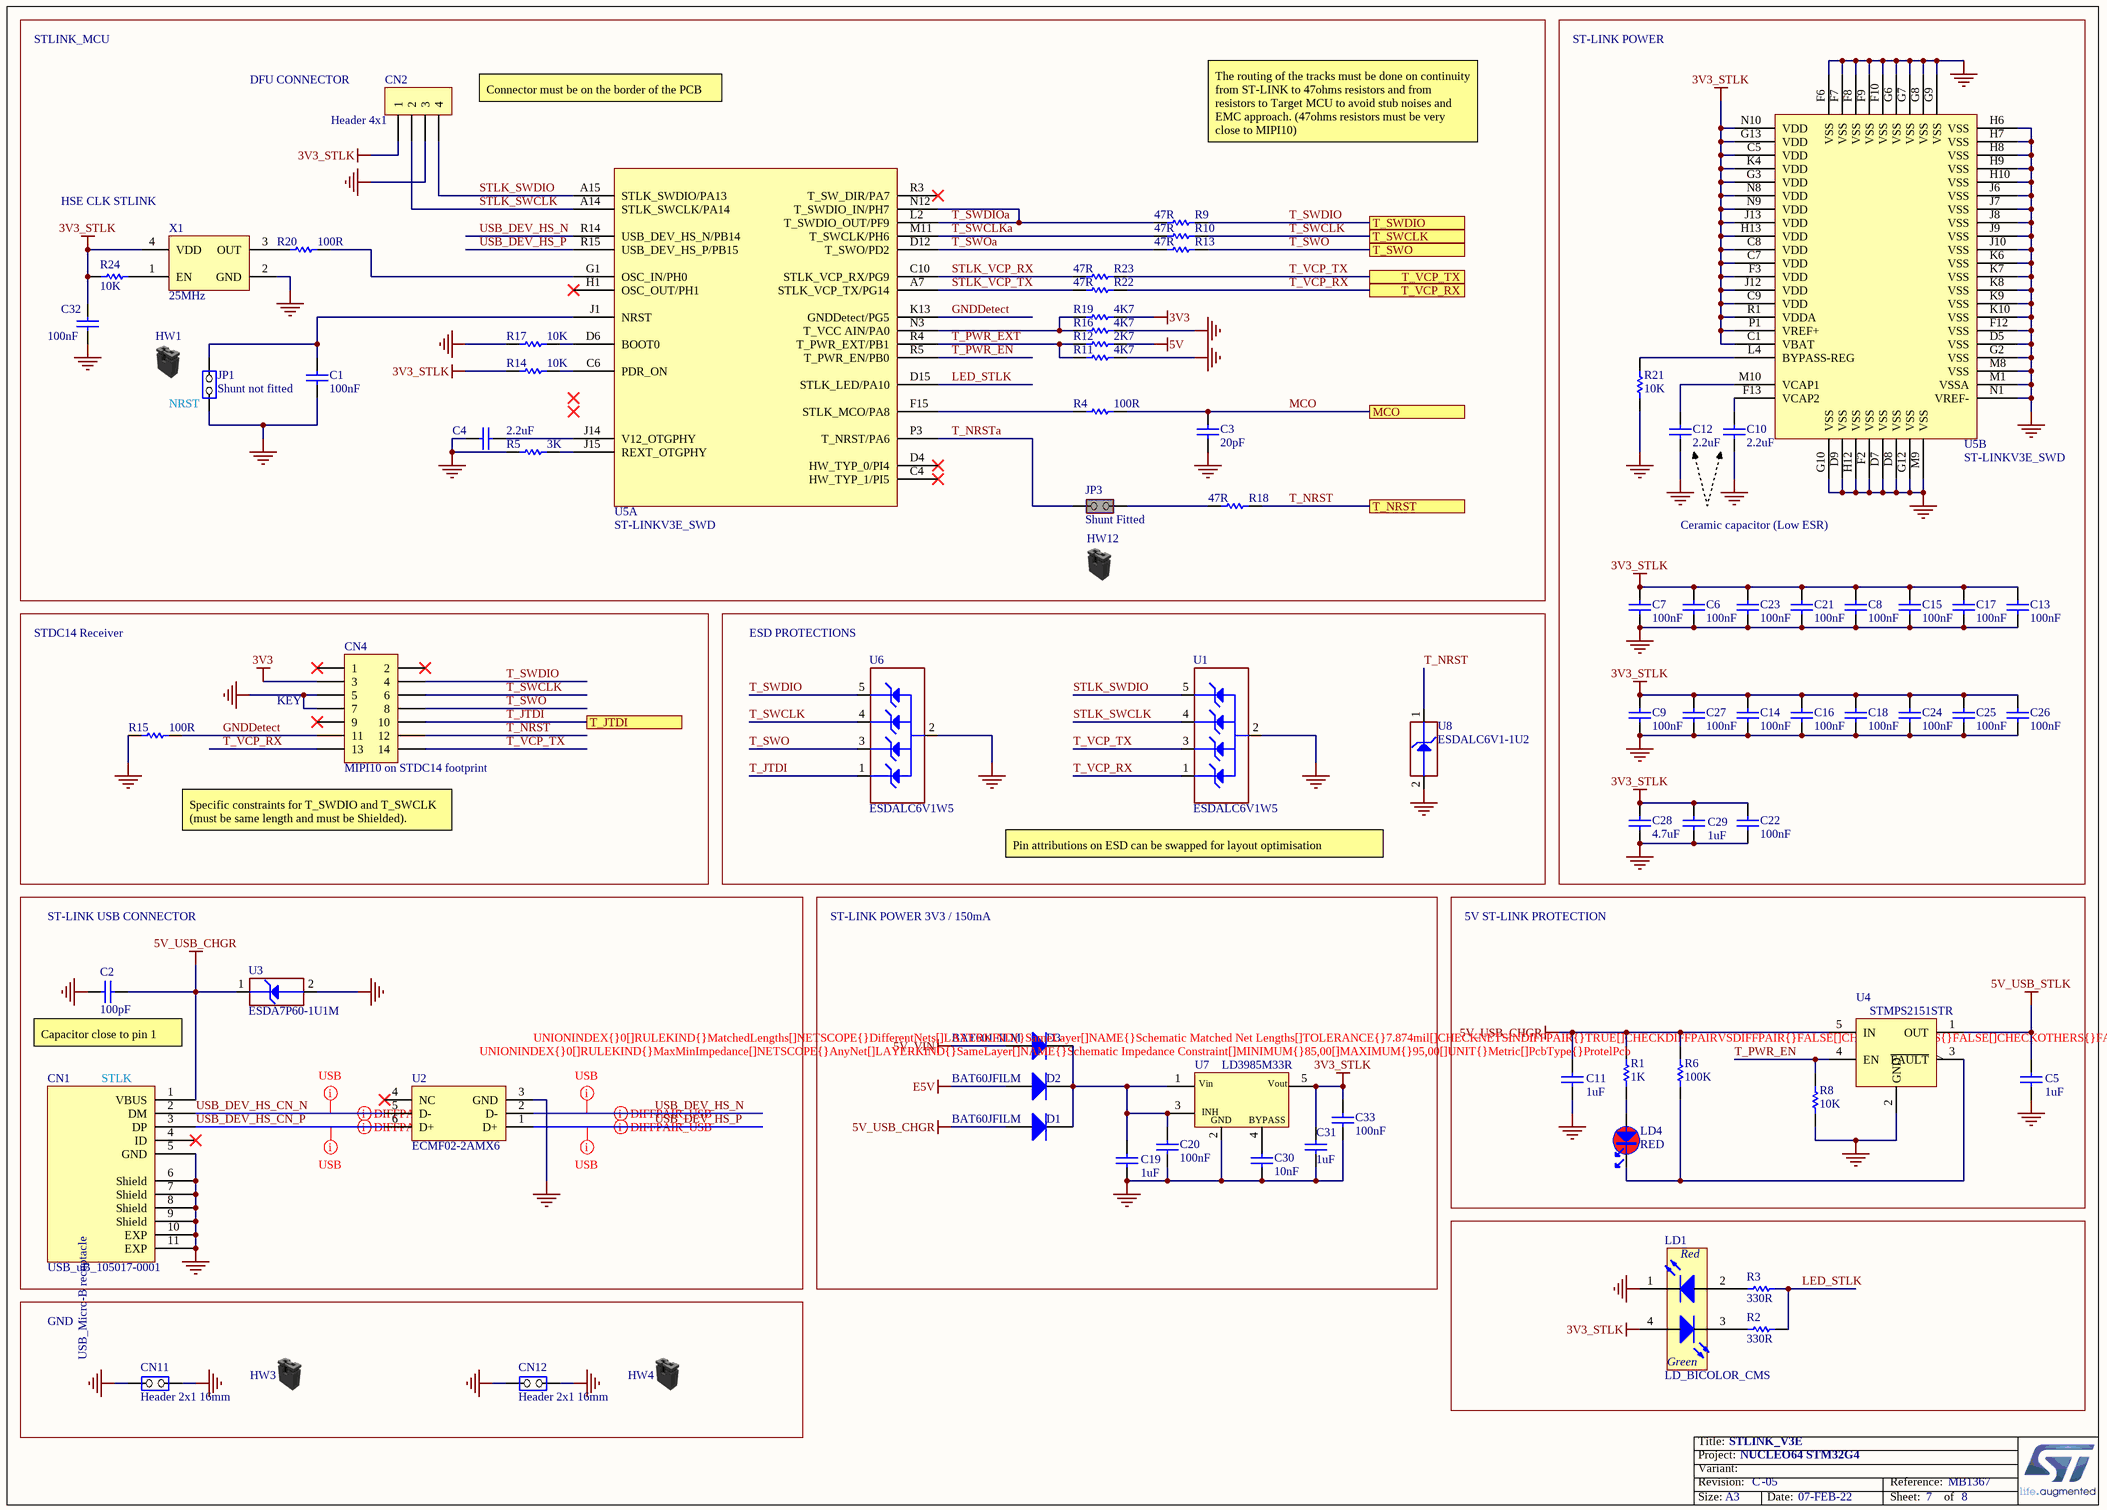
[diagram p3: ST_LINK_V3E.SchDoc]

### Parts
C1  value 100nF  [C0402]
C2  value 100pF  [C0402]
C3  value 20pF  [C0402]
C4  value 2.2uF  [C0603]
C5  value 1uF  [C0603]
C6  value 100nF  [C0402]
C7  value 100nF  [C0402]
C8  value 100nF  [C0402]
C9  value 100nF  [C0402]
C10  value 2.2uF  [C1206_H1P15]
C11  value 1uF  [C0603]
C12  value 2.2uF  [C1206_H1P15]
C13  value 100nF  [C0402]
C14  value 100nF  [C0402]
C15  value 100nF  [C0402]
C16  value 100nF  [C0402]
C17  value 100nF  [C0402]
C18  value 100nF  [C0402]
C19  value 1uF  [C0603]
C20  value 100nF  [C0402]
C21  value 100nF  [C0402]
C22  value 100nF  [C0402]
C23  value 100nF  [C0402]
C24  value 100nF  [C0402]
C25  value 100nF  [C0402]
C26  value 100nF  [C0402]
C27  value 100nF  [C0402]
C28  value 4.7uF  [C0603]
C29  value 1uF  [C0603]
C30  value 10nF  [C0402]
C31  value 1uF  [C0603]
C32  value 100nF  [C0402]
C33  value 100nF  [C0402]
CN1  value USB_uB_105017-0001  [CON_USBMICROB_MOLEX_105017-0001_H2P90]
CN2  value Header 4x1  [CON_SAMTEC_TSW-104-07-G-S]
CN4  value MIPI10 on STDC14 footprint  [CON_STDC14_Receiver_MEDIUM_WITH_MIPI10_3D]
CN11  value Header 2x1 16mm  [CON_SAMTEC_TSW-102-09-X-S]
CN12  value Header 2x1 16mm  [CON_SAMTEC_TSW-102-09-X-S]
D1  value BAT60JFILM  [DIO_SOD323]
D2  value BAT60JFILM  [DIO_SOD323]
D3  value BAT60JFILM  [DIO_SOD323]
HW1  (no value)  (mechanical)
HW3  (no value)  (mechanical)
HW4  (no value)  (mechanical)
HW12  (no value)  (mechanical)
JP1  value Shunt not fitted  [CON_SAMTEC_TSW-102-07-G-S]
JP3  Shunt Fitted  [CON_SAMTEC_TSW-102-07-G-S]
LD1  LD_BICOLOR_CMS  [LED_BI-GR_HSMF-A201-A00J1]
LD4  value RED  [LED_0603_RED_H0P4]  (hidden comment: LED_red)
R1  value 1K  [R0603]
R2  value 330R  [R0603]
R3  value 330R  [R0603]
R4  value 100R  [R0402]
R5  value 3K  [R0402]
R6  value 100K  [R0603]
R8  value 10K  [R0603]
R9  value 47R  [R0402]
R10  value 47R  [R0402]
R11  value 4K7  [R0402]
R12  value 2K7  [R0402]
R13  value 47R  [R0402]
R14  value 10K  [R0402]
R15  value 100R  [R0402]
R16  value 4K7  [R0402]
R17  value 10K  [R0402]
R18  value 47R  [R0402]
R19  value 4K7  [R0402]
R20  value 100R  [R0402]
R21  value 10K  [R0402]
R22  value 47R  [R0402]
R23  value 47R  [R0402]
R24  value 10K  [R0402]
U1  value ESDALC6V1W5  [ESD_SOT323-5L]
U2  value ECMF02-2AMX6  [ESD_QFN-6L_1P7X1P5_P050]  (hidden comment: ​)
U3  value ESDA7P60-1U1M  [ESD_QFN2_1P6X1_P125]
U4  value STMPS2151STR  [MOS_SOT23-5L]
U5  value ST-LINKV3E_SWD  [ICC_UFBGA201_176+25_10X10_P065]  (parts A,B of 2)
U6  value ESDALC6V1W5  [ESD_SOT323-5L]
U7  value LD3985M33R  [REG_SOT23-5L]
U8  value ESDALC6V1-1U2  [ESD_ST0201]
X1  value 25MHz  [OSC_NDK_NZ2520SB_4P]

### Blocks framed on the sheet
ESD PROTECTIONS: U1 U6 U8
ST-LINK POWER 3V3 / 150mA: C19 C20 C30 C31 C33 D1-D3 U7
5V ST-LINK PROTECTION: C5 C11 LD4 R1 R6 R8 U4
GND: CN11 CN12 HW3 HW4

### Ports
MCO, T_JTDI, T_NRST, T_SWCLK, T_SWDIO, T_SWO, T_VCP_RX, T_VCP_TX

### Nets
3V3: CN4.3 R19.2
3V3_STLK: C6.2 C7.2 C8.2 C9.2 C13.2 C14.2 C15.2 C16.2 C17.2 C18.2 C21.2 C22.2 C23.2 C24.2 C25.2 C26.2 C27.2 C28.2 C29.2 C31.2 C32.2 C33.2 CN2.1 LD1.4(YellowGreen_anode) R14.1 R24.1 U5.C1(VBAT) U5.C5(VDD) U5.C7(VDD) U5.C8(VDD) U5.C9(VDD) U5.F3(VDD) U5.G3(VDD) U5.G13(VDD) U5.H13(VDD) U5.J12(VDD) U5.J13(VDD) U5.K4(VDD) U5.N8(VDD) U5.N9(VDD) U5.N10(VDD) U5.P1(VREF+) U5.R1(VDDA) U7.5(Vout) X1.4(VDD)
5V: R12.1
5V_USB_CHGR: C2.2 C11.2 CN1.1(VBUS) D1.1(A) R1.2 R6.2 U3.1(IO1) U4.5(IN)
5V_USB_STLK: C5.2 U4.1(OUT)
5V_VIN: D3.1(A)
E5V: D2.1(A)
GND: C1.1 C2.1 C3.1 C4.1 C5.1 C6.1 C7.1 C8.1 C9.1 C10.1 C11.1 C12.1 C13.1 C14.1 C15.1 C16.1 C17.1 C18.1 C19.1 C20.1 C21.1 C22.1 C23.1 C24.1 C25.1 C26.1 C27.1 C28.1 C29.1 C30.1 C31.1 C32.1 C33.1 CN1.5(GND) CN1.6(Shield) CN1.7(Shield) CN1.8(Shield) CN1.9(Shield) CN1.10(EXP) CN1.11(EXP) CN2.3 CN4.5 CN4.7 CN11.1(COMMON) CN11.2(NO) CN12.1(COMMON) CN12.2(NO) JP1.1(COMMON) LD1.1(RED_cathode) R5.1 R8.2 R11.1 R15.1 R16.2 R17.1 R21.1 U1.2(GND) U2.3(GND) U3.2(GND) U4.2(GND) U5.D5(VSS) U5.D7(VSS) U5.D8(VSS) U5.D9(VSS) U5.F2(VSS) U5.F6(VSS) U5.F7(VSS) U5.F8(VSS) U5.F9(VSS) U5.F10(VSS) U5.F12(VSS) U5.G2(VSS) U5.G6(VSS) U5.G7(VSS) U5.G8(VSS) U5.G9(VSS) U5.G10(VSS) U5.G12(VSS) U5.H6(VSS) U5.H7(VSS) U5.H8(VSS) U5.H9(VSS) U5.H10(VSS) U5.H12(VSS) U5.J6(VSS) U5.J7(VSS) U5.J8(VSS) U5.J9(VSS) U5.J10(VSS) U5.K6(VSS) U5.K7(VSS) U5.K8(VSS) U5.K9(VSS) U5.K10(VSS) U5.M1(VSSA) U5.M8(VSS) U5.M9(VSS) U5.N1(VREF-) U6.2(GND) U7.2(GND) U8.2(GND) X1.2(GND)
GNDDetect: CN4.11 R15.2 U5.K13(GNDDetect/PG5)
LED_STLK: R2.2 R3.2 U5.D15(STLK_LED/PA10)
MCO: C3.2 R4.2 ; port MCO
STLK_SWCLK: CN2.2 U1.4(IO3) U5.A14(STLK_SWCLK/PA14)
STLK_SWDIO: CN2.4 U1.5(IO4) U5.A15(STLK_SWDIO/PA13)
STLK_VCP_RX: R23.1 U5.C10(STLK_VCP_RX/PG9)
STLK_VCP_TX: R22.1 U5.A7(STLK_VCP_TX/PG14)
T_JTDI: CN4.10 U6.1(IO1) ; port T_JTDI
T_NRST: CN4.12 R18.2 U8.1(IO1) ; port T_NRST
T_NRSTa: JP3.1(COMMON) U5.P3(T_NRST/PA6)
T_PWR_EN: R8.1 U4.4(EN) U5.R5(T_PWR_EN/PB0)
T_PWR_EXT: R11.2 R12.2 U5.R4(T_PWR_EXT/PB1)
T_SWCLK: CN4.6 R10.2 U6.4(IO3) ; port T_SWCLK
T_SWCLKa: R10.1 U5.M11(T_SWCLK/PH6)
T_SWDIO: CN4.4 R9.2 U6.5(IO4) ; port T_SWDIO
T_SWDIOa: R9.1 U5.L2(T_SWDIO_OUT/PF9) U5.N12(T_SWDIO_IN/PH7)
T_SWO: CN4.8 R13.2 U6.3(IO2) ; port T_SWO
T_SWOa: R13.1 U5.D12(T_SWO/PD2)
T_VCP_RX: CN4.13 R22.2 U1.1(IO1) ; port T_VCP_RX
T_VCP_TX: CN4.14 R23.2 U1.3(IO2) ; port T_VCP_TX
USB_DEV_HS_CN_N: CN1.2(DM) U2.5(D-)
USB_DEV_HS_CN_P: CN1.3(DP) U2.6(D+)
USB_DEV_HS_N: U2.2(D-) U5.R14(USB_DEV_HS_N/PB14)
USB_DEV_HS_P: U2.1(D+) U5.R15(USB_DEV_HS_P/PB15)
NetC1_2: C1.2 JP1.2(NO) U5.J1(NRST)
NetC4_2: C4.2 U5.J14(V12_OTGPHY)
NetC10_2: C10.2 U5.F13(VCAP2)
NetC12_2: C12.2 U5.M10(VCAP1)
NetC19_2: C19.2 C20.2 D1.2(K) D2.2(K) D3.2(K) U7.1(Vin) U7.3(CE)
NetC30_2: C30.2 U7.4(BYPASS)
NetJP3_2: JP3.2(NO) R18.1
NetLD1_2: LD1.2(Red_anode) R3.1
NetLD1_3: LD1.3(YellowGreen_cathode) R2.1
NetLD4_1: LD4.1 R1.1
NetLD4_2: LD4.2 R6.1 U4.3(~{FAULT})
NetR4_1: R4.1 U5.F15(STLK_MCO/PA8)
NetR5_2: R5.2 U5.J15(REXT_OTGPHY)
NetR14_2: R14.2 U5.C6(PDR_ON)
NetR16_1: R16.1 R19.1 U5.N3(T_VCC_AIN/PA0)
NetR17_2: R17.2 U5.D6(BOOT0)
NetR20_1: R20.1 X1.3(OUT)
NetR20_2: R20.2 U5.G1(OSC_IN/PH0)
NetR21_2: R21.2 U5.L4(BYPASS-REG)
NetR24_2: R24.2 X1.1(EN)

Not connected (* = marked no-connect by the designer): CN1 4(ID)*; CN4 1* 2* 9*; U2 4(NC)*; U5 C4(HW_TYP_1/PI5)* D4(HW_TYP_0/PI4)* H1(OSC_OUT/PH1)* R3(T_SW_DIR/PA7)*

### Layout directives
differential pair; rule Impedance Constraint [Min = 85.00    Max = 95.00    ]: USB_DEV_HS_CN_N, USB_DEV_HS_CN_P, USB_DEV_HS_N, USB_DEV_HS_P
rule Undefined; rule Matched Net Lengths [Tolerance = 0.2mm]; rule Impedance Constraint [Min = 85.00    Max = 95.00    ]: USB_DEV_HS_CN_N, USB_DEV_HS_CN_P, USB_DEV_HS_N, USB_DEV_HS_P

### Notes on the sheet
- STLINK_MCU
- ST-LINK POWER
- DFU CONNECTOR
- (near CN2) Connector must be on the border of the PCB
- The routing of the tracks must be done on continuity from ST-LINK to 47ohms resistors and from resistors to Target MCU to avoid stub noises and EMC approach. (47ohms resistors must be very close to MIPI10)
- HSE CLK STLINK
- (near JP1) NRST
- Ceramic capacitor (Low ESR)
- STDC14 Receiver
- (near CN4) KEY
- Specific constraints for T_SWDIO and T_SWCLK (must be same length and must be Shielded).
- Pin attributions on ESD can be swapped for layout optimisation
- ST-LINK USB CONNECTOR
- (near C2) Capacitor close to pin 1
- (near CN1) STLK
- Title:
- Project:
- Size:
- Revision:
- Variant:
- A3
- -
- Date:
- Reference:
- Sheet:
- of
- (in symbol MCD-00028) USB_Micro-B receptacle
- (in symbol MCD-00086) INH
- (in symbol MCD-02402) Red; Green

### Library data of the parts
C1 C6-C9 C13-C18 C20-C27 C32 C33 = MCD-00102: as C36 on sheet Power; Internal_Part_Number: MCD-00102; Status: Released; Package: C0402; ComponentLink1Description: Yageo_Capacitor_X7R-series.pdf; ECCN_US: n/a; ECCN_EU: n/a; Part_Type: Capacitor; ComponentLink1URL: http://tunmcdsvn.tun.st.com/Component_Datasheet_Library/Trunk/Capacitors/Yageo_Multilayer_Capacitor_X7R_series_100pF_to_22uF
C2 = MCD-00205: Capacitor, MLCC, 100pF, 50V, NPO, 5%, 0402, T=0,5mm; Manufacturer_Part_Number: CC0402JRNPO9BN101; Manufacturer: YAGEO; Provided_By: Subcon; Internal_Part_Number: MCD-00205; Status: Footprint available; Part_Type: Capacitor; Package: C0402; ComponentLink1Description: Yageo_Capacitor_NP0_16V-to-50V.pdf; ComponentLink1URL: http://tunmcdsvn.tun.st.com/Component_Datasheet_Library/Trunk/Capacitors/Yageo_Capacitor_NP0_16V-to-50V
C3 = MCD-00016: Capacitor, MLCC, 20pF, 50V, NPO, 5%, 0402, T=0,5mm; Manufacturer_Part_Number: CC0402JRNPO9BN200; Manufacturer: YAGEO; Provided_By: Subcon; Initial_Board_Reference: MB1274; Internal_Part_Number: MCD-00016; Status: Released; Package: C0402; ComponentLink1Description: Yageo_Capacitor_NP0_16V-to-50V.pdf; ECCN_US: n/a; ECCN_EU: n/a; Part_Type: Capacitor; ComponentLink1URL: http://tunmcdsvn.tun.st.com/Component_Datasheet_Library/Trunk/Capacitors/Yageo_Capacitor_NP0_16V-to-50V
C4 = MCD-00012: Capacitor, MLCC, 2.2uF, 10V, X5R, 10%, 0603, T=0,8mm; Manufacturer_Part_Number: CC0603KRX5R6BB225; Manufacturer: YAGEO; Alternate_Manufacturer_Part_Number: C0603C225K8PACTU; Alternate_Manufacturer: KEMET; Provided_By: Subcon; Initial_Board_Reference: MB1274; Internal_Part_Number: MCD-00012; Status: Released; Package: C0603; ComponentLink1Description: Yageo_Capacitor_X5R-series.pdf; ECCN_US: n/a; ECCN_EU: n/a; Part_Type: Capacitor; ComponentLink1URL: http://tunmcdsvn.tun.st.com/Component_Datasheet_Library/Trunk/Capacitors/Yageo_Multilayer_capacitor_X5R_series_100pF_to_100uF
C5 C11 C19 C29 C31 = MCD-00010: as C37 on sheet Power; Internal_Part_Number: MCD-00010; Status: Released; Package: C0603; ComponentLink1Description: Yageo_Capacitor_X5R-series.pdf; ECCN_US: n/a; ECCN_EU: n/a; Part_Type: Capacitor; ComponentLink1URL: http://tunmcdsvn.tun.st.com/Component_Datasheet_Library/Trunk/Capacitors/Yageo_Multilayer_capacitor_X5R_series_100pF_to_100uF
C10 C12 = MCD-00008: Capacitor, MLCC, 2.2uF, 16V, X7R, 10%, 1206, T=1,15mm; Manufacturer_Part_Number: CC1206KKX7R7BB225; Manufacturer: YAGEO; Alternate_Manufacturer_Part_Number: C1206C225K4RAC; Alternate_Manufacturer: KEMET; Provided_By: Subcon; Initial_Board_Reference: MB1274; Internal_Part_Number: MCD-00008; Status: Released; Package: C1206; ComponentLink1Description: Yageo_Capacitor_X7R-series.pdf; ECCN_US: n/a; ECCN_EU: n/a; Part_Type: Capacitor; ComponentLink1URL: http://tunmcdsvn.tun.st.com/Component_Datasheet_Library/Trunk/Capacitors/Yageo_Multilayer_Capacitor_X7R_series_100pF_to_22uF
C28 = MCD-00009: Capacitor, MLCC, 4.7uF, 16V, X5R, 10%, 0603, T=0.8mm; Manufacturer_Part_Number: CC0603KRX5R7BB475; Manufacturer: YAGEO; Provided_By: subcon; Initial_Board_Reference: MB1274; Internal_Part_Number: MCD-00009; Status: Released; Part_Type: Capacitor; Package: C0603; ComponentLink1Description: Yageo_Capacitor_X5R-series.pdf; ECCN_US: n/a; ECCN_EU: n/a; ComponentLink1URL: http://tunmcdsvn.tun.st.com/Component_Datasheet_Library/Trunk/Capacitors/Yageo_Multilayer_capacitor_X5R_series_100pF_to_100uF
C30 = MCD-00011: Capacitor, MLCC, 10nF, 16V, X7R, 10%, 0402, T=0.5mm; Manufacturer_Part_Number: CC0402KRX7R7BB103; Manufacturer: YAGEO; Provided_By: Subcon; Initial_Board_Reference: MB1274; Internal_Part_Number: MCD-00011; Status: Released; Part_Type: Capacitor; Package: C0402; ComponentLink1Description: Yageo_Capacitor_X7R-series.pdf; ECCN_US: n/a; ECCN_EU: n/a; ComponentLink1URL: http://tunmcdsvn.tun.st.com/Component_Datasheet_Library/Trunk/Capacitors/Yageo_Multilayer_Capacitor_X7R_series_100pF_to_22uF
CN1 = MCD-00028: USB-MICRO-B, 0.65mm, RA, SMT, Bottom Mount,; Manufacturer_Part_Number: 1050170001; Manufacturer: MOLEX; Part_Type: Connector; Provided_By: Subcon; Initial_Board_Reference: MB1274; Internal_Part_Number: MCD-00028; Status: Released; ComponentLink1Description: Molex_Connector-USB-microB_105017-0001.pdf; ECCN_US: n/a; ECCN_EU: n/a; ComponentLink1URL: http://tunmcdsvn.tun.st.com/Component_Datasheet_Library/Trunk/Connectors/Molex_Connector-USB-microB_105017-0001
CN2 = MCD-00029: Header, 4x1, 2,54mm, VR, TH, Height 5.84mm/2.54mm; Manufacturer_Part_Number: TSW-104-07-x-S; Manufacturer: SAMTEC; Part_Type: Connector; Provided_By: Subcon; Initial_Board_Reference: MB1274; Internal_Part_Number: MCD-00029; Status: Released; ComponentLink1Description: Samtec_connector_TSW-HTSW-series.pdf; ECCN_US: n/a; ECCN_EU: n/a; ComponentLink1URL: http://tunmcdsvn.tun.st.com/Component_Datasheet_Library/Trunk/Connectors/Samtec_TSW-HTSW-series
CN4 = MCD-01226: Header 5x2, 1.27mm, Dual row, Straight, Surface mount, vertical male connector. 3.05mm lead. Mates with FFSD connector. Footprint compatible with FTSH-107-01-L-DV,-K,-A,-P,-ES (STDC14 MEDIUM); Manufacturer_Part_Number: FTSH-105-01-L-DV-K; Manufacturer: SAMTEC; Alternate_Manufacturer_Part_Number: P127B-2x05MGF-079-0A; Alternate_Manufacturer: JIUBABA; Provided_By: SUBCO; Internal_Part_Number: MCD-01226; Status: Released; Part_Type: Connector; ComponentLink1Description: Datasheet; ComponentLink1URL: http://tunmcdsvn.tun.st.com/Component_Datasheet_Library/Trunk/Connectors/Samtec_FTSH_smt_series; ECCN_US: n/a; ECCN_EU: n/a
CN11 CN12 = MCD-00214: Header, 2x1, 2,54mm, VR, TH, Height 5.84mm/10.16mm; Part_Type: Connector; Manufacturer_Part_Number: TSW-102-09-x-S; Manufacturer: SAMTEC; Provided_By: Subcon; Initial_Board_Reference: MB1319; Internal_Part_Number: MCD-00214; Status: Released; ComponentLink1Description: Samtec_connector_TSW-HTSW-series.pdf; ComponentLink1URL: http://tunmcdsvn.tun.st.com/Component_Datasheet_Library/Trunk/Connectors/Samtec_TSW-HTSW-series; ECCN_US: n/a; ECCN_EU: n/a
D1-D3 = MCD-00034: BAT60JFILM; Manufacturer: STMICROELECTRONICS; Part_Type: Diode; ECCN_US: EAR99; ECCN_EU: NEC; Provided_By: Subcon; Initial_Board_Reference: MB1274; Internal_Part_Number: MCD-00034; Manufacturer_Part_Number: BAT60JFILM; ComponentLink1Description: STM_Diode_BAT60JFILM-SOD323.pdf; Status: Released; ComponentLink1URL: http://tunmcdsvn.tun.st.com/Component_Datasheet_Library/Trunk/Diodes/STM_Diode_BAT60JFILM-SOD323
HW1 HW3 HW4 HW12 = MCD-00043: as HW5 on sheet Power; Internal_Part_Number: MCD-00043; ECCN_US: n/a; ECCN_EU: n/a; ComponentLink1Description: Samtec_Shunt_Jumper_SNT100.pdf; Status: Released; ComponentLink1URL: http://tunmcdsvn.tun.st.com/Component_Datasheet_Library/Trunk/Connectors/Samtec_Shunt_Jumper_SNT100
JP1 = MCD-00045: Header, 2x1, 2,54mm, VR, TH, Height 5.84mm/2.54mm; Part_Type: Connector; Manufacturer_Part_Number: TSW-102-07-x-S; Manufacturer: SAMTEC; Provided_By: Subcon; Initial_Board_Reference: MB1274; Internal_Part_Number: MCD-00045; Status: Released; ComponentLink1Description: Samtec_connector_TSW-HTSW-series.pdf; ComponentLink1URL: http://tunmcdsvn.tun.st.com/Component_Datasheet_Library/Trunk/Connectors/Samtec_TSW-HTSW-series; ECCN_US: n/a; ECCN_EU: n/a
JP3 = MCD-00683: as JP6 on sheet Power; Internal_Part_Number: MCD-00683; Value: Shunt Fitted; Status: Released; ComponentLink1Description: Samtec_connector_TSW-HTSW-series.pdf; ComponentLink1URL: http://tunmcdsvn.tun.st.com/Component_Datasheet_Library/Trunk/Connectors/Samtec_TSW-HTSW-series; ECCN_US: n/a; ECCN_EU: n/a
LD1 = MCD-02402: LED Bicolor; Part_Type: Display; Part_Preference: Alternate; Manufacturer: EVERLIGHT; Manufacturer_Part_Number: 67-22sursygc-s530-a2-tr8; Alternate_Internal_Part_Number: MCD-00051; Alternate_EMS: C; ShowFields: YES; ID: 4508; Internal_Part_Number: MCD-02402; Value: LD_BICOLOR_CMS; Status: Released; ComponentLink1URL: http://tunmcdsvn.tun.st.com/Component_Documentation_Library/Trunk/Display/EVERLIGHT_67-22sursygc-s530-a2-tr8; Order_Code_Digikey: N/A; Order_Code_Farnell: N/A; Order_Code_RS: N/A
LD4 = MCD-02787: LED, Red, VF : Min=1.7V , Max=2.2V, IF : 25mA, 0603 SMD; Part_Type: Display; Part_Preference: Recommended; Manufacturer: EVERLIGHT; Manufacturer_Part_Number: 19-217/R6C-AL1M2VY/6T; ShowFields: YES; ID: 4899; Internal_Part_Number: MCD-02787; Status: New; Package: 0603; ComponentLink1URL: http://tunmcdsvn.tun.st.com/Component_Documentation_Library/Trunk/Display/EVERLIGHT_19-217-R6C-AL1M2VY-6T; Order_Code_Digikey: 1080-19-217/R6C-AL1M2VY/6TTR-ND; Order_Code_Farnell: N/A; Order_Code_RS: N/A
R1 = MCD-00070: as R30 on sheet Arduino_extension_connectors; Internal_Part_Number: MCD-00070; ECCN_US: n/a; ECCN_EU: n/a; ComponentLink1Description: Yageo_Resistor_RC0603-series.pdf; Status: Released; Part_Type: Resistor; Package: R0603; ComponentLink1URL: http://tunmcdsvn.tun.st.com/Component_Datasheet_Library/Trunk/Resistors/Yageo_Resistor_RC0603-series
R2 R3 = MCD-00197: Resistor,330R,0603,1%,1/10W; Manufacturer_Part_Number: RC0603FR-07330RL; Manufacturer: YAGEO; Provided_By: Subcon; Internal_Part_Number: MCD-00197; Status: Released; ComponentLink1Description: Yageo_Resistor_RC0603-series.pdf; ECCN_US: n/a; ECCN_EU: n/a; Part_Type: Resistor; Package: R0603; ComponentLink1URL: http://tunmcdsvn.tun.st.com/Component_Datasheet_Library/Trunk/Resistors/Yageo_Resistor_RC0603-series
R4 R15 R20 = MCD-00119: Resistor,100R,0402,1%,1/16W; Manufacturer_Part_Number: RC0402FR-07100RL; Manufacturer: YAGEO; Provided_By: Subcon; Initial_Board_Reference: MB1262; Internal_Part_Number: MCD-00119; Status: Released; Part_Type: Resistor; ComponentLink1Description: Yageo_Resistor_RC0402-series.pdf; ECCN_US: n/a; ECCN_EU: n/a; Package: R0402; ComponentLink1URL: http://tunmcdsvn.tun.st.com/Component_Datasheet_Library/Trunk/Resistors/Yageo_Resistor_RC0402-series
R5 = MCD-00185: Resistor,3K,0402,1%,1/16W; Manufacturer_Part_Number: RC0402FR-073KL; Manufacturer: YAGEO; Provided_By: Subcon; Internal_Part_Number: MCD-00185; Status: Released; ComponentLink1Description: Yageo_Resistor_RC0402-series.pdf; ECCN_US: n/a; ECCN_EU: n/a; Part_Type: Resistor; Package: R0402; ComponentLink1URL: http://tunmcdsvn.tun.st.com/Component_Datasheet_Library/Trunk/Resistors/Yageo_Resistor_RC0402-series
R6 = MCD-00223: as R28 on sheet Arduino_extension_connectors; Internal_Part_Number: MCD-00223; Status: Released; Part_Type: Resistor; Package: R0603; ComponentLink1Description: Yageo_Resistor_RC0603-series.pdf; ComponentLink1URL: http://tunmcdsvn.tun.st.com/Component_Datasheet_Library/Trunk/Resistors/Yageo_Resistor_RC0603-series; ECCN_US: n/a; ECCN_EU: n/a
R8 = MCD-00220: Resistor,10K,0603,1%,1/10W; Manufacturer_Part_Number: RC0603FR-0710KL; Manufacturer: YAGEO; Provided_By: Subcon; Initial_Board_Reference: MB1319; Internal_Part_Number: MCD-00220; ECCN_US: n/a; ECCN_EU: n/a; ComponentLink1Description: Yageo_Resistor_RC0603-series.pdf; Status: Released; Part_Type: Resistor; Package: R0603; ComponentLink1URL: http://tunmcdsvn.tun.st.com/Component_Datasheet_Library/Trunk/Resistors/Yageo_Resistor_RC0603-series
R9 R10 R13 R18 R22 R23 = MCD-00481: Resistor,47R,0402,1%,1/16W; Manufacturer_Part_Number: RC0402FR-0747RL; Manufacturer: YAGEO; Provided_By: SUBCO; ECCN_US: EAR99; ECCN_EU: NEC; Internal_Part_Number: MCD-00481; Status: Released; Part_Type: Resistor; Package: R0402; ComponentLink1Description: Datasheet; ComponentLink1URL: http://tunmcdsvn.tun.st.com/Component_Datasheet_Library/Trunk/Resistors/Yageo_Resistor_RC0402-series
R11 R16 R19 = MCD-00065: Resistor,4K7,0402,1%,1/16W; Manufacturer_Part_Number: RC0402FR-074K7L; Manufacturer: YAGEO; Alternate_Manufacturer_Part_Number: RT0402FRE074K7L; Provided_By: Subcon; Initial_Board_Reference: MB1274; Internal_Part_Number: MCD-00065; Status: Released; ComponentLink1Description: Yageo_Resistor_RC0402-series.pdf; ECCN_US: n/a; ECCN_EU: n/a; Alternate_Manufacturer: YAGEO; Part_Type: Resistor; Package: R0402; ComponentLink1URL: http://tunmcdsvn.tun.st.com/Component_Datasheet_Library/Trunk/Resistors/Yageo_Resistor_RC0402-series
R12 = MCD-00055: Resistor,2K7,0402,1%,1/16W; Manufacturer_Part_Number: RC0402FR-072K7L; Manufacturer: YAGEO; Provided_By: Subcon; Initial_Board_Reference: MB1274; Internal_Part_Number: MCD-00055; Status: Released; ComponentLink1Description: Yageo_Resistor_RC0402-series.pdf; ECCN_US: n/a; ECCN_EU: n/a; Part_Type: Resistor; Package: R0402; ComponentLink1URL: http://tunmcdsvn.tun.st.com/Component_Datasheet_Library/Trunk/Resistors/Yageo_Resistor_RC0402-series
R14 R17 R21 R24 = MCD-00053: Resistor,10K,0402,1%,1/16W; Manufacturer_Part_Number: RC0402FR-0710KL; Manufacturer: YAGEO; Provided_By: subcon; Initial_Board_Reference: MB1274; Internal_Part_Number: MCD-00053; Status: Released; ComponentLink1Description: Yageo_Resistor_RC0402-series.pdf; ECCN_US: n/a; ECCN_EU: n/a; Part_Type: Resistor; Package: R0402; ComponentLink1URL: http://tunmcdsvn.tun.st.com/Component_Datasheet_Library/Trunk/Resistors/Yageo_Resistor_RC0402-series
U1 U6 = MCD-00136: Dual Transil array for ESD protection; Part_Type: Diode; Manufacturer: STMICROELECTRONICS; ECCN_US: EAR99; ECCN_EU: NEC; Provided_By: Subcon; Initial_Board_Reference: MB1262; Internal_Part_Number: MCD-00136; Status: Released; Manufacturer_Part_Number: ESDALC6V1W5; ComponentLink1Description: STM_ESD_ESDALC6V1W5.pdf; ComponentLink1URL: http://tunmcdsvn.tun.st.com/Component_Datasheet_Library/Trunk/Diodes/STM_ESD_ESDALC6V1W5
U2 = MCD-00649: Common mode filter with ESD protection for USB 2.0 interface; Part_Type: Diode; Manufacturer: STMICROELECTRONICS; ECCN_US: EAR99; ECCN_EU: NEC; Provided_By: Subcon; Initial_Board_Reference: MB1248; Internal_Part_Number: MCD-00649; Status: Footprint available; Manufacturer_Part_Number: ECMF02-2AMX6; ComponentLink1Description: STM_ESD_ECMF02-2AMX6.pdf; ComponentLink1URL: http://tunmcdsvn.tun.st.com/Component_Datasheet_Library/Trunk/Diodes/STM_ESD_ECMF02-2AMX6
U3 = MCD-00251: High power transient voltage suppressor, 7V breakdown; Part_Type: IC; Manufacturer: STMICROELECTRONICS; ECCN_US: EAR99; ECCN_EU: NEC; Provided_By: Subcon; Initial_Board_Reference: MB1311; Internal_Part_Number: MCD-00251; Status: Released; Manufacturer_Part_Number: ESDA7P60-1U1M; ComponentLink1Description: STM_ESD_ESDA7P60-1U1M.pdf; ComponentLink1URL: http://tunmcdsvn.tun.st.com/Component_Datasheet_Library/Trunk/Diodes/STM_ESD_ESDA7P60-1U1M
U4 = MCD-00159: 500mA, Enhanced single channel power switches with active high enable pin; Part_Type: IC; Manufacturer: STMICROELECTRONICS; Alternate_Manufacturer_Part_Number: TPS2051C; Alternate_Manufacturer: TEXAS INSTRUMENTS; ECCN_US: EAR99; ECCN_EU: NEC; Provided_By: Subcon; Initial_Board_Reference: MB1264; Internal_Part_Number: MCD-00159; Status: Footprint available; Manufacturer_Part_Number: STMPS2151STR; ComponentLink1Description: STM_PWR-Switch_STMPS2151STR.pdf; ComponentLink1URL: http://tunmcdsvn.tun.st.com/Component_Datasheet_Library/Trunk/IC/STM_PWR-Switch_STMPS2151STR
U5 = MCD-00596: STM32F723IEK  (STM32F7) BGA176; Part_Type: IC; Manufacturer_Part_Number: STM32F723IEK6; Manufacturer: STMICROELECTRONICS; BMS_Part_Number: 9175300; Provided_By: SUBCO with ST control; ECCN_US: 3A991A2; ECCN_EU: NEC; Internal_Part_Number: MCD-00596; Status: Released; ComponentLink1Description: Datasheet; ComponentLink1URL: http://tunmcdsvn.tun.st.com/Component_Datasheet_Library/Trunk/IC/BGA176+25L_10x10x0.6_pitch0.65
U7 = MCD-00086: Ultra low drop-low noise BiCMOS voltage, regulators low ESR capacitors compatible; Manufacturer: STMICROELECTRONICS; Part_Type: IC; ECCN_US: EAR99; ECCN_EU: NEC; Provided_By: Subcon; Initial_Board_Reference: MB1274; Internal_Part_Number: MCD-00086; Status: Released; Manufacturer_Part_Number: LD3985M33R; ComponentLink1Description: STM_LDO_LD3985.pdf; ComponentLink1URL: http://tunmcdsvn.tun.st.com/Component_Datasheet_Library/Trunk/IC/STM_LDO_LD3985
U8 = MCD-00170: ESD protection 6V1; Part_Type: Diode; Manufacturer: STMICROELECTRONICS; ECCN_US: EAR99; ECCN_EU: NEC; Provided_By: Subcon; Initial_Board_Reference: MB1274; Internal_Part_Number: MCD-00170; Status: Released; Manufacturer_Part_Number: ESDALC6V1-1U2; ComponentLink1Description: STM_ESD_ESDALC6V1-1U2.pdf; ComponentLink1URL: http://tunmcdsvn.tun.st.com/Component_Datasheet_Library/Trunk/Diodes/STM_ESD_ESDALC6V1-1U2
X1 = MCD-00597: Oscillator 25.00Mhz, -+50PPM, 3.3V, Temp -55 to +125°C; Manufacturer_Part_Number: NZ2520SB 25MHz END4869B; Manufacturer: NDK; Alternate_Manufacturer_Part_Number: KC2520B25.0000C10E00; Alternate_Manufacturer: AVX CORP/KYOCERA CORP; Part_Type: Crystal_Osc; Provided_By: STM; Initial_Board_Reference: MB1331; Internal_Part_Number: MCD-00597; Status: Footprint available; ComponentLink1Description: NDK_OSCILLATOR_NZ2520SB.pdf; ComponentLink1URL: http://tunmcdsvn.tun.st.com/Component_Datasheet_Library/Trunk/Crystal_Osc/NDK_OSCILLATOR_NZ2520SB; Order_Code_Digikey: 478-4780-1-ND; ECCN_US: n/a; ECCN_EU: n/a

## Nets that join several sheets
3V3: Arduino_extension_connectors (CN6.4 CN7.16 R25.1 SB39.1), Power (JP6.1 SB5.2), ST_LINK_V3E (CN4.3 R19.2)
5V: Arduino_extension_connectors (CN6.5 CN7.18), Power (11 pins), ST_LINK_V3E (R12.1)
5V_USB_CHGR: Arduino_extension_connectors (CN10.8), Power (JP5.7), ST_LINK_V3E (8 pins)
5V_USB_STLK: Power (JP5.1), ST_LINK_V3E (C5.2 U4.1)
5V_VIN: Arduino_extension_connectors (R30.2), Power (C38.2 JP5.3 U11.2 U11.4), ST_LINK_V3E (D3.1)
AGND: Arduino_extension_connectors (CN10.32), Power (C46.1 C50.1 R34.1 U14.5)
E5V: Arduino_extension_connectors (CN7.6), Power (JP5.5), ST_LINK_V3E (D2.1)
GND: Arduino_extension_connectors (11 pins), Power (10 pins), ST_LINK_V3E (102 pins)
VDD: Arduino_extension_connectors (CN7.5), Power (JP6.2)
VIN: Arduino_extension_connectors (CN6.8 CN7.24), Power (C41.2 U11.3)
T_NRST: Arduino_extension_connectors (CN6.3 CN7.14), ST_LINK_V3E (CN4.12 R18.2 U8.1)

## Assembly variants
G474RE: not fitted C3 CN2 HW1 HW20 HW110 R6 SB8 SB10 SB12 SB14 SB18 SB20 SB21 SB22 SB24 SB27 SB28 SB29 SB32 SB34 SB37
G431RB: not fitted C3 CN2 HW1 HW20 HW110 R6 SB8 SB10 SB12 SB14 SB18 SB20 SB21 SB22 SB24 SB27 SB28 SB29 SB32 SB34 SB37
G491RE: not fitted C3 CN2 HW1 HW20 HW110 R6 SB8 SB10 SB12 SB14 SB18 SB20 SB21 SB22 SB24 SB27 SB28 SB29 SB32 SB34 SB37
WS: not fitted C3 CN2 HW1 HW20 R6 SB8 SB10 SB12 SB14 SB18 SB20 SB21 SB22 SB24 SB27 SB28 SB29 SB32 SB34 SB37